# Altium project Project_1_27102024.PrjPcb
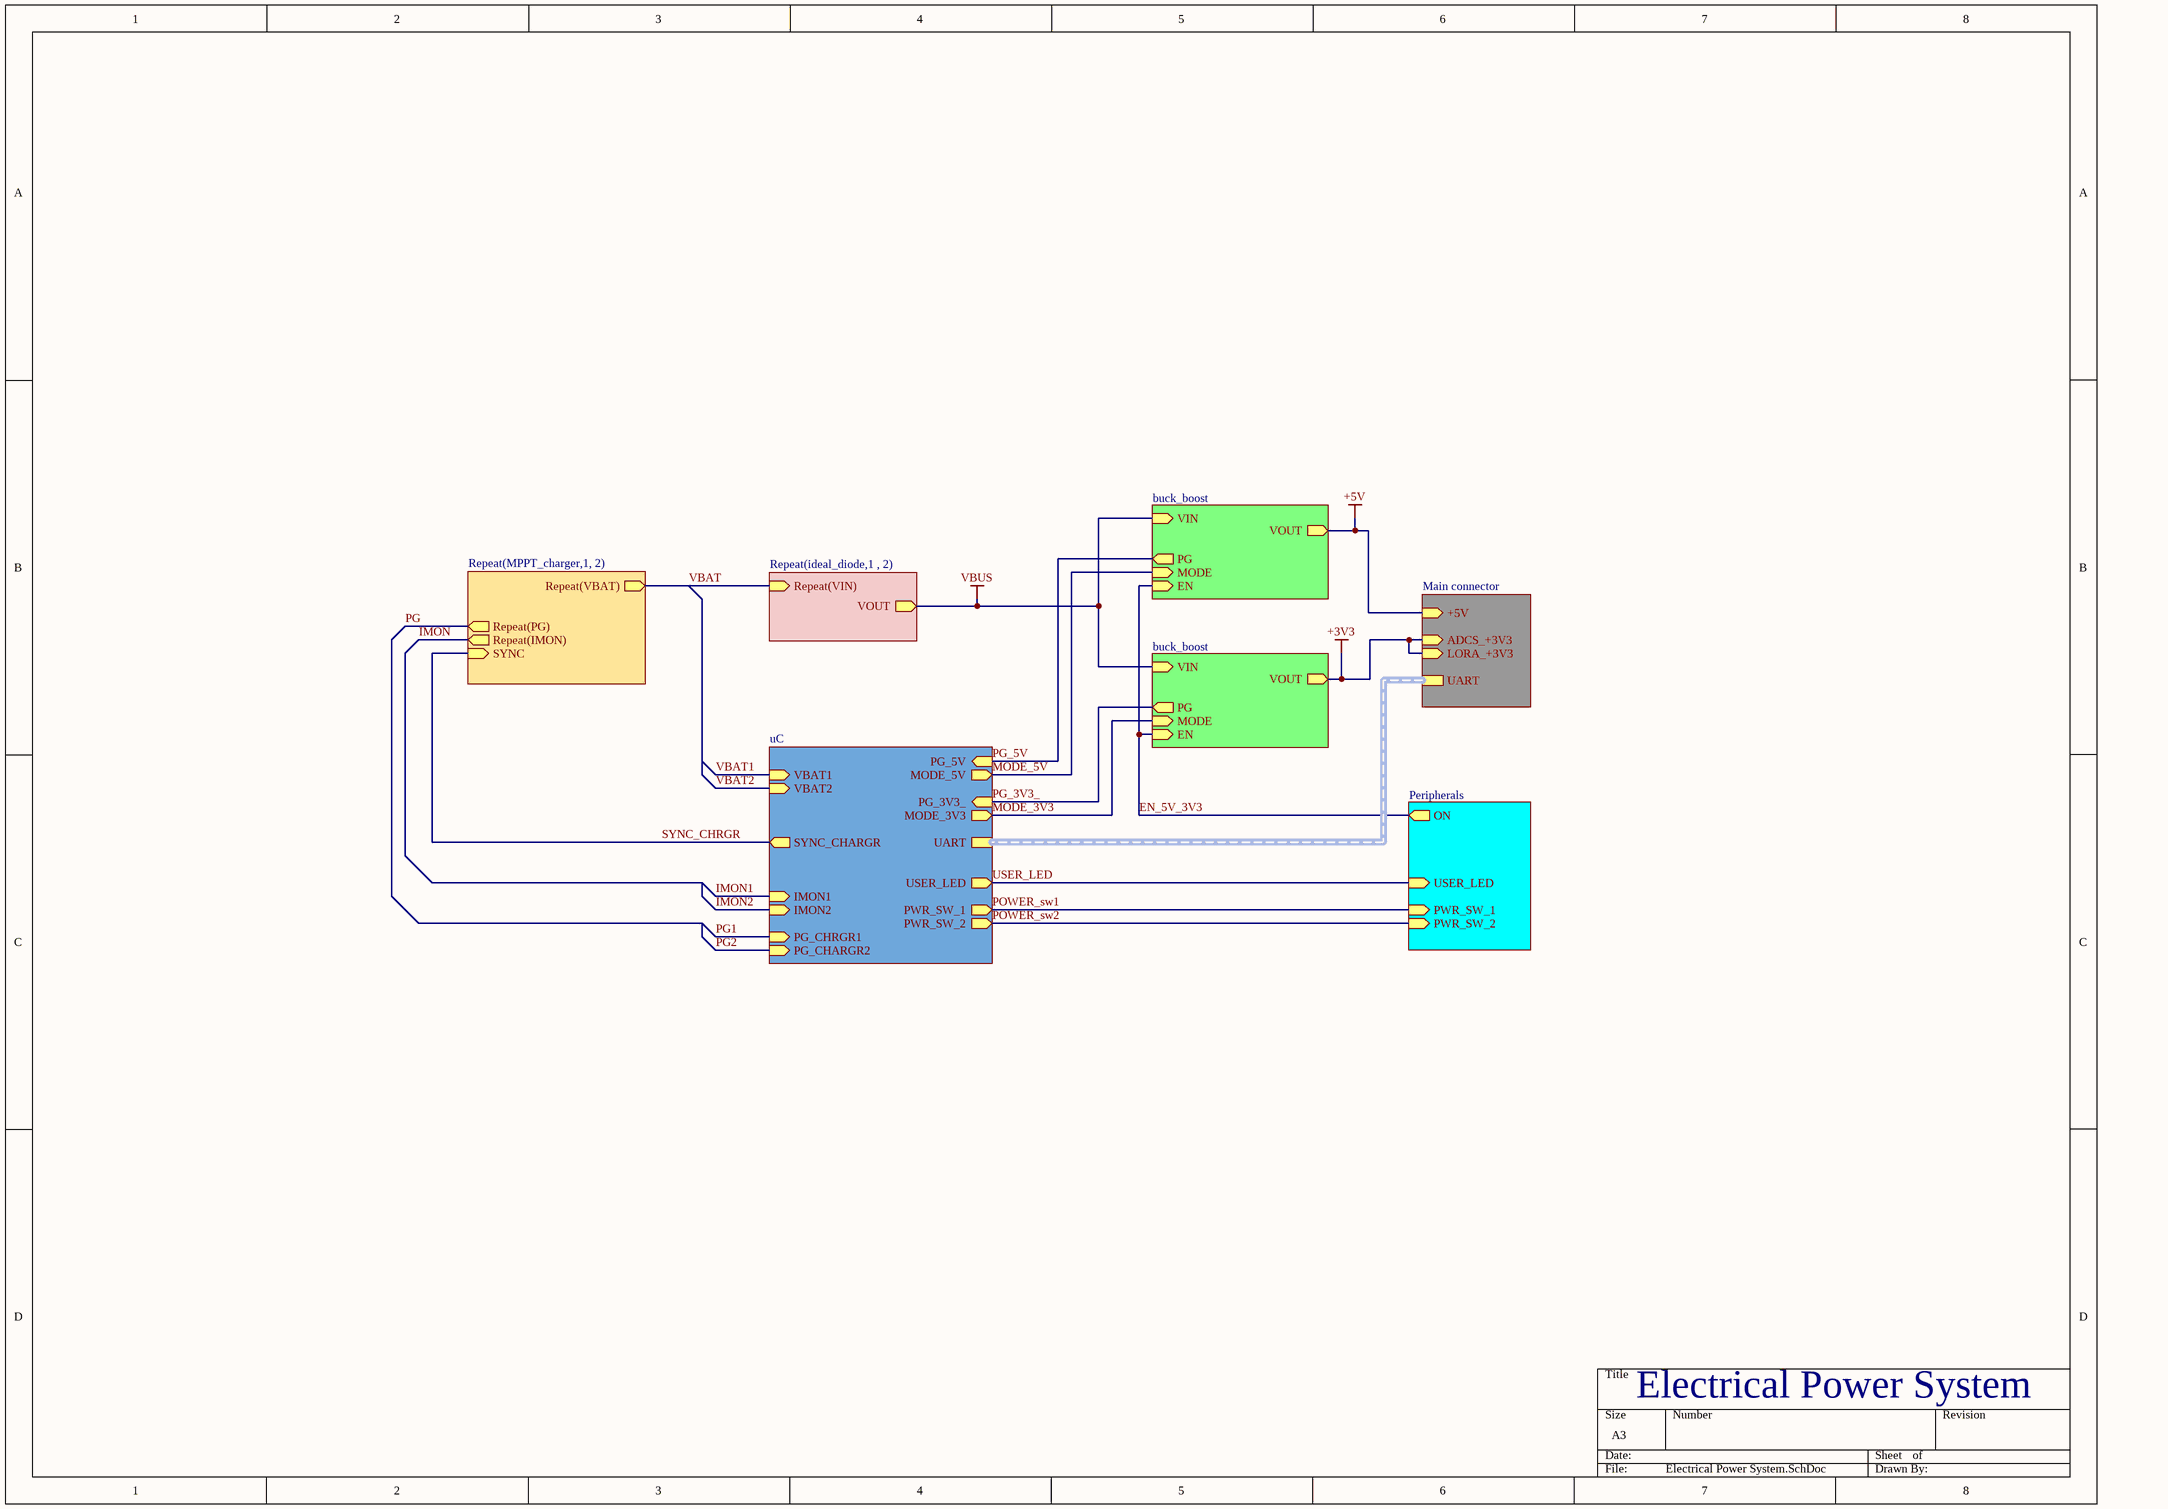
[diagram p0: Electrical Power System.SchDoc]
7 sheets, 124 parts. Net scope: hierarchical (ports join the sheet entries above them; power ports are global).
Board files: PCB-4-Layer.PcbDoc, PCB-2-Layer.PcbDoc, PCB-2-Layer_(1).PcbDoc
Sheets:
  Electrical Power System.SchDoc
    U_Microcontroller = uC.SchDoc
    MPPT_charger1 = Repeat(MPPT_charger,1, 2).SchDoc
    MPPT_charger2 = Repeat(MPPT_charger,1, 2).SchDoc
    ideal diode1 = Repeat(ideal_diode,1 , 2).SchDoc
    ideal diode2 = Repeat(ideal_diode,1 , 2).SchDoc
    U_Buck - Boost Converter = buck_boost.SchDoc
    U_LEDs Connector = Peripherals.SchDoc
    U_Board-to-board Connector = Main connector.SchDoc
    U_Buck - Boost Converter = buck_boost.SchDoc

## Sheet Electrical Power System.SchDoc
size A3; SheetNumber: 1; SheetTotal: 7

### Sub-sheets
Repeat(ideal diode, 1, 2) = Repeat(ideal_diode,1 , 2): VOUT (out), Repeat(VIN) (in)
Repeat(MPPT_charger, 1, 2) = Repeat(MPPT_charger,1, 2): SYNC (in), Repeat(IMON) (out), Repeat(PG) (out), Repeat(VBAT) (out)
U_Board-to-board Connector = Main connector: ADCS_+3V3 (in), LORA_+3V3 (in), +5V (in), UART (harness *)
U_Buck - Boost Converter = buck_boost: VIN (in), MODE (in), EN (in), PG (out), VOUT (out)
U_Buck - Boost Converter = buck_boost: VIN (in), MODE (in), EN (in), PG (out), VOUT (out)
U_LEDs Connector = Peripherals: USER_LED (in), PWR_SW_1 (in), PWR_SW_2 (in), ON (out)
U_Microcontroller = uC: IMON1 (in), IMON2 (in), SYNC_CHARGR (out), PG_3V3_ (in), MODE_3V3 (out), PG_5V (in), MODE_5V (out), PG_CHRGR1 (in), PG_CHARGR2 (in), USER_LED (out), PWR_SW_2 (out), PWR_SW_1 (out), UART (harness *), VBAT1 (in), VBAT2 (in)

### Nets
+3V3: sheet U_Board-to-board Connector/ADCS_+3V3, sheet U_Board-to-board Connector/LORA_+3V3, sheet U_Buck - Boost Converter/VOUT
+5V: sheet U_Buck - Boost Converter/VOUT, sheet U_Board-to-board Connector/+5V
VBUS: sheet Repeat(ideal diode, 1, 2)/VOUT, sheet U_Buck - Boost Converter/VIN, sheet U_Buck - Boost Converter/VIN  [project net SENSE]
EN_5V_3V3: sheet U_Buck - Boost Converter/EN, sheet U_LEDs Connector/ON, sheet U_Buck - Boost Converter/EN  [project net EN]
IMON: sheet Repeat(MPPT_charger, 1, 2)/Repeat(IMON)
MODE_3V3: sheet U_Microcontroller/MODE_3V3, sheet U_Buck - Boost Converter/MODE
MODE_5V: sheet U_Microcontroller/MODE_5V, sheet U_Buck - Boost Converter/MODE
PG: sheet Repeat(MPPT_charger, 1, 2)/Repeat(PG)
PG_3V3_: sheet U_Microcontroller/PG_3V3_, sheet U_Buck - Boost Converter/PG
PG_5V: sheet U_Microcontroller/PG_5V, sheet U_Buck - Boost Converter/PG
POWER_sw1: sheet U_Microcontroller/PWR_SW_1, sheet U_LEDs Connector/PWR_SW_1
POWER_sw2: sheet U_Microcontroller/PWR_SW_2, sheet U_LEDs Connector/PWR_SW_2
SYNC_CHRGR: sheet U_Microcontroller/SYNC_CHARGR, sheet Repeat(MPPT_charger, 1, 2)/SYNC
USER_LED: sheet U_Microcontroller/USER_LED, sheet U_LEDs Connector/USER_LED
VBAT: sheet Repeat(MPPT_charger, 1, 2)/Repeat(VBAT), sheet Repeat(ideal diode, 1, 2)/Repeat(VIN)

### Buses and harness runs
harness sheet U_Board-to-board Connector/UART = sheet U_Microcontroller/UART

### Notes on the sheet
- Electrical Power System

## Sheet uC.SchDoc
size A3; SheetNumber: 2; SheetTotal: 7
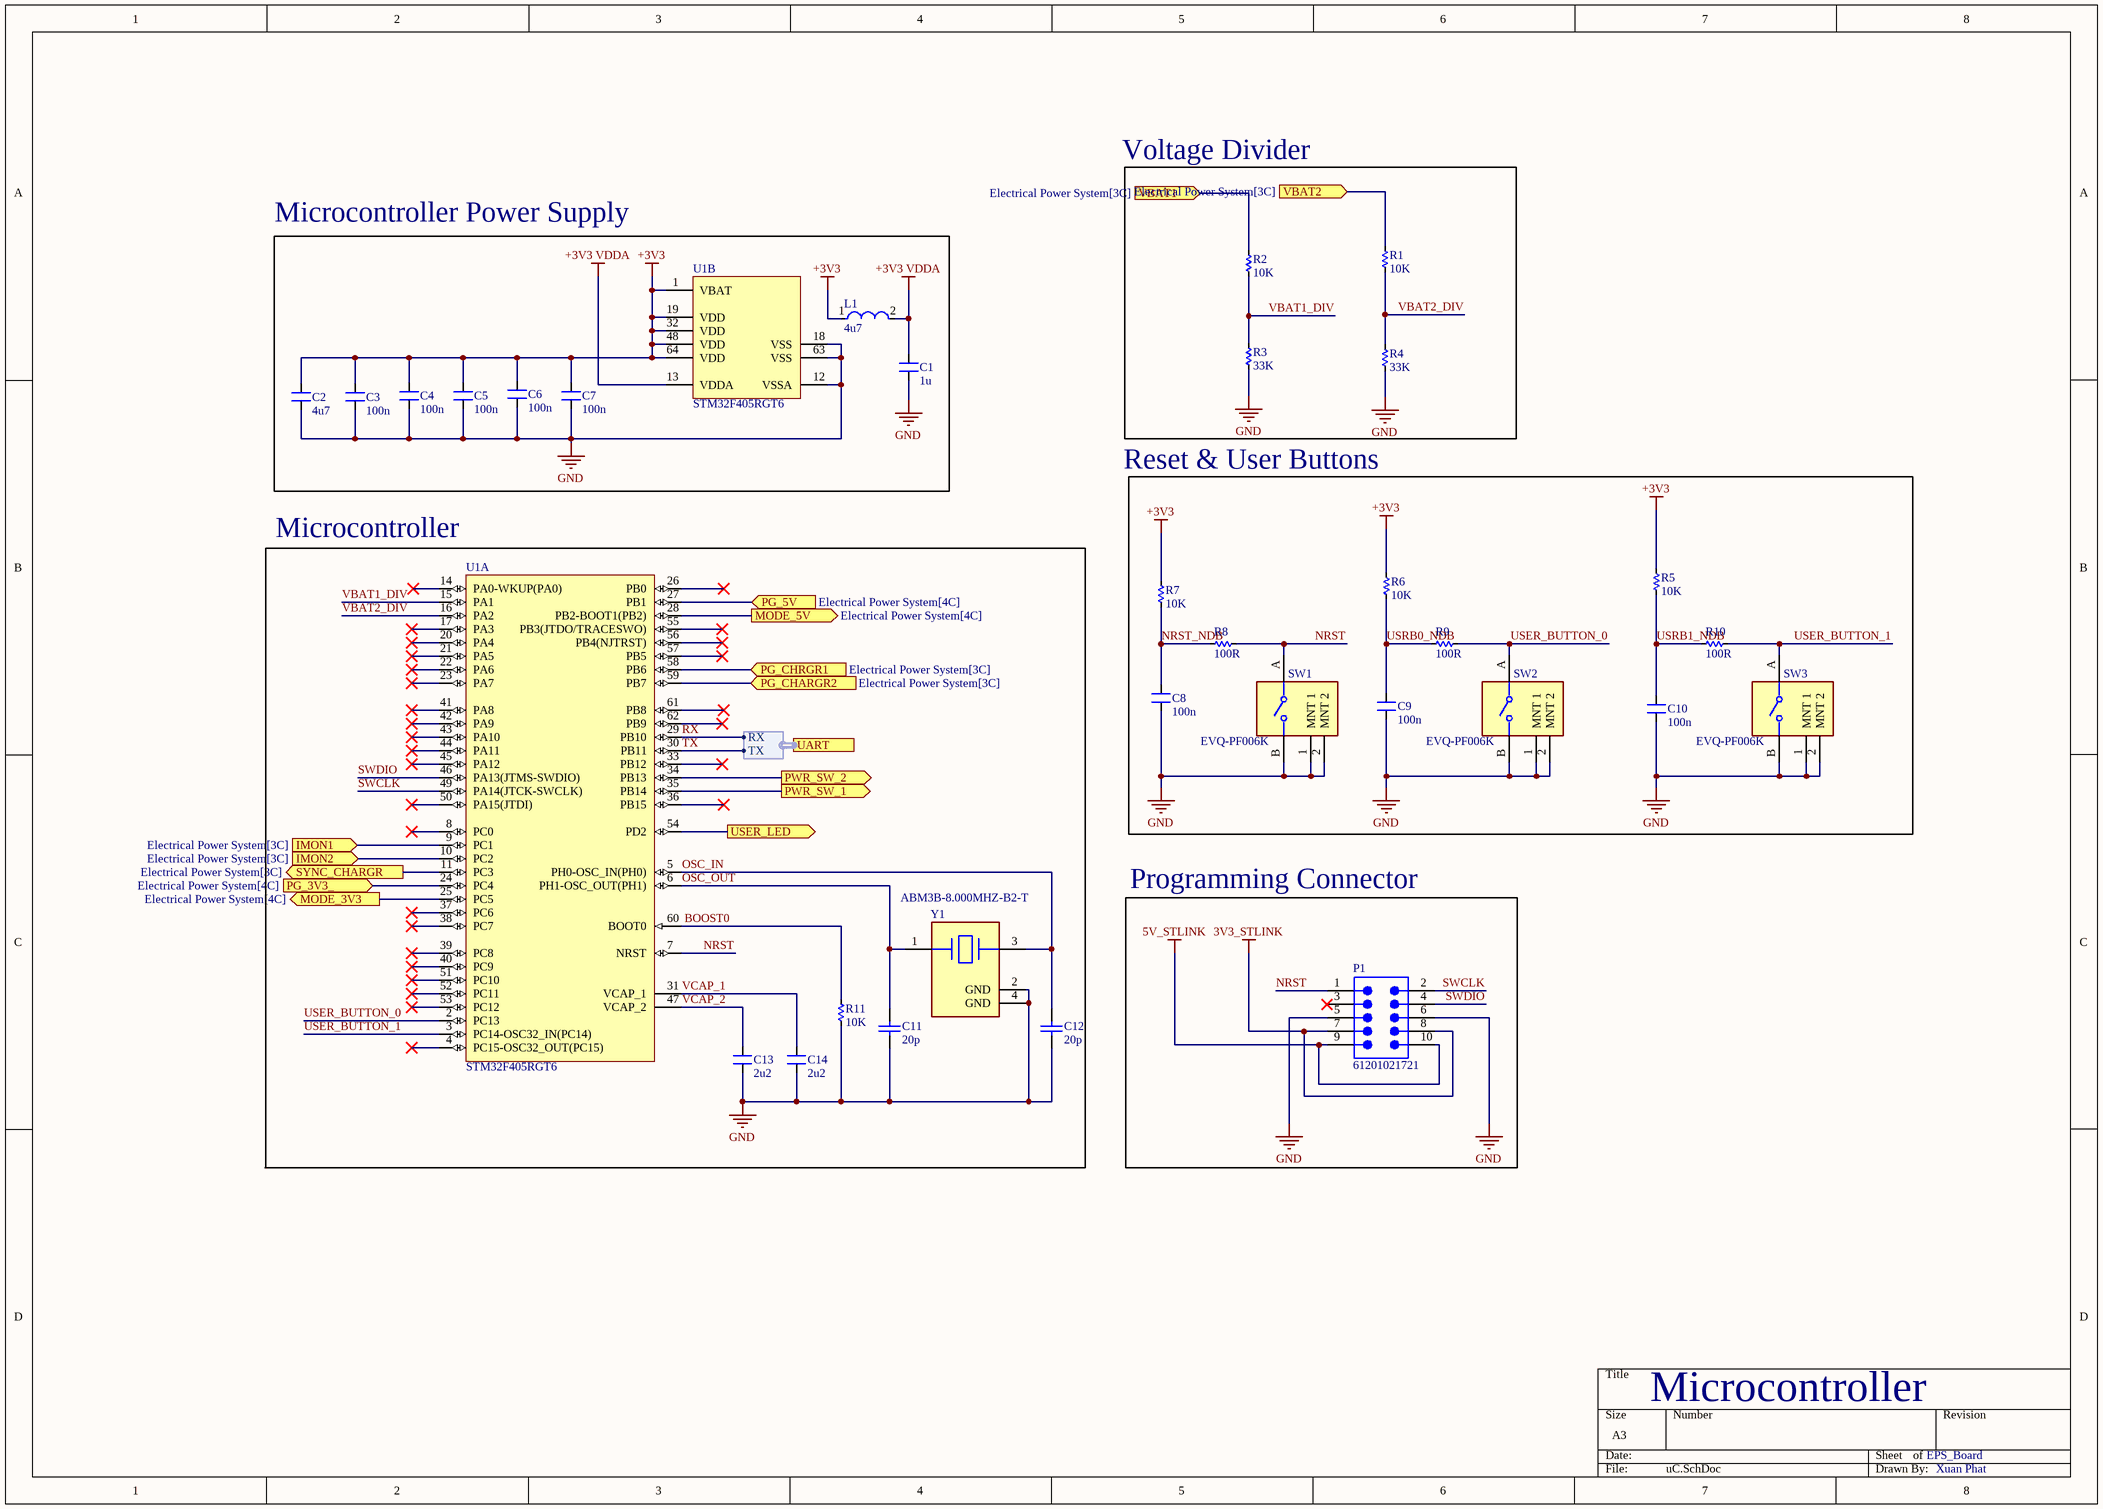
[diagram p1: uC.SchDoc]

### Parts
C1  1u  [CN-SMD-0603]
C2  4u7  [CN-SMD-0603]
C3  100n  [CN-SMD-0603]
C4  100n  [CN-SMD-0603]
C5  100n  [CN-SMD-0603]
C6  100n  [CN-SMD-0603]
C7  100n  [CN-SMD-0603]
C8  100n  [CN-SMD-0603]
C9  100n  [CN-SMD-0603]
C10  100n  [CN-SMD-0603]
C11  20p  [CAPC1608X90X30LL10T20]
C12  20p  [CAPC1608X90X30LL10T20]
C13  2u2  [CN-SMD-0603]
C14  2u2  [CN-SMD-0603]
L1  4u7  [FP-LQM2HPN_G0-IPC_A]
P1  61201021721  [61201021721]
R1  10K  [RES-SMD-0805]
R2  10K  [RES-SMD-0805]
R3  33K  [RES-SMD-0805]
R4  33K  [RES-SMD-0805]
R5  10K  [RES-SMD-0805]
R6  10K  [RES-SMD-0805]
R7  10K  [RES-SMD-0805]
R8  100R  [RES-SMD-0805]
R9  100R  [RES-SMD-0805]
R10  100R  [RES-SMD-0805]
R11  10K  [RES-SMD-0805]
SW1  EVQ-PF006K  [FP-EVQ-PF006K-MFG]
SW2  EVQ-PF006K  [FP-EVQ-PF006K-MFG]
SW3  EVQ-PF006K  [FP-EVQ-PF006K-MFG]
U1  STM32F405RGT6  [STM-LQFP64_M]  (parts A,B of 2)
Y1  ABM3B-8.000MHZ-B2-T  [FP-ABM3B-MFG]

### Blocks framed on the sheet
Voltage Divider: R1-R4
Microcontroller Power Supply: C1-C7 L1 U1
Microcontroller: C11-C14 R11 U1 Y1
Programming Connector: P1

### Ports
IMON1 (in, see Electrical Power System[3C]), IMON2 (in, see Electrical Power System[3C]), MODE_3V3 (out, see Electrical Power System[4C]), MODE_5V (out, see Electrical Power System[4C]), PG_3V3_ (in, see Electrical Power System[4C]), PG_5V (in, see Electrical Power System[4C]), PG_CHARGR2 (in, see Electrical Power System[3C]), PG_CHRGR1 (in, see Electrical Power System[3C]), PWR_SW_1 (out, see Electrical Power System[4C], Peripherals[2B]), PWR_SW_2 (out, see Electrical Power System[4C], Peripherals[2C]), SYNC_CHARGR (out, see Electrical Power System[3C]), UART (harness *, see Electrical Power System[4C], Main connector[3C]), USER_LED (out, see Electrical Power System[4C], Peripherals[1B]), VBAT1 (in, see Electrical Power System[3C]), VBAT2 (in, see Electrical Power System[3C])

### Harnesses
*: RX, TX

### Nets
3V3_STLINK: P1.7 P1.8
5V_STLINK: P1.9 P1.10
+3V3: C2.2 C3.2 C4.2 C5.2 C6.2 C7.2 L1.1 R5.1 R6.1 R7.1 U1.1(VBAT) U1.19(VDD) U1.32(VDD) U1.48(VDD) U1.64(VDD)
+3V3 VDDA: C1.2 L1.2 U1.13(VDDA)
GND: C1.1 C2.1 C3.1 C4.1 C5.1 C6.1 C7.1 C8.1 C9.1 C10.1 C11.1 C12.1 C13.1 C14.1 P1.5 P1.6 R3.2 R4.2 R11.2 SW1.1(MNT_1) SW1.2(MNT_2) SW1.B SW2.1(MNT_1) SW2.2(MNT_2) SW2.B SW3.1(MNT_1) SW3.2(MNT_2) SW3.B U1.12(VSSA) U1.18(VSS) U1.63(VSS) Y1.2(GND) Y1.4(GND)
BOOST0: R11.1 U1.60(BOOT0)
IMON1: U1.9(PC1) ; port IMON1
IMON2: U1.10(PC2) ; port IMON2
MODE_3V3: U1.25(PC5) ; port MODE_3V3
MODE_5V: U1.28(PB2-BOOT1(PB2)) ; port MODE_5V
NRST: P1.1 R8.2 SW1.A U1.7(NRST)
NRST_NDB: C8.2 R7.2 R8.1
OSC_IN: C12.2 U1.5(PH0-OSC_IN(PH0)) Y1.3
OSC_OUT: C11.2 U1.6(PH1-OSC_OUT(PH1)) Y1.1
PG: U1.58(PB6) ; port PG_CHRGR1
PG: U1.59(PB7) ; port PG_CHARGR2  [a separate net that carries the same name]
PG_3V3_: U1.24(PC4) ; port PG_3V3_
PG_5V: U1.27(PB1) ; port PG_5V
POWER_sw1: U1.35(PB14) ; port PWR_SW_1
POWER_sw2: U1.34(PB13) ; port PWR_SW_2
RX: U1.29(PB10) ; port UART.RX
SWCLK: P1.2 U1.49(PA14(JTCK-SWCLK))
SWDIO: P1.4 U1.46(PA13(JTMS-SWDIO))
SYNC_CHRGR: U1.11(PC3) ; port SYNC_CHARGR
TX: U1.30(PB11) ; port UART.TX
USER_BUTTON_0: R9.2 SW2.A U1.2(PC13)
USER_BUTTON_1: R10.2 SW3.A U1.3(PC14-OSC32_IN(PC14))
USER_LED: U1.54(PD2) ; port USER_LED
USRB0_NDB: C9.2 R6.2 R9.1
USRB1_NDB: C10.2 R5.2 R10.1
VBAT1: R2.1 ; port VBAT1
VBAT1_DIV: R2.2 R3.1 U1.15(PA1)
VBAT2: R1.1 ; port VBAT2
VBAT2_DIV: R1.2 R4.1 U1.16(PA2)
VCAP_1: C14.2 U1.31(VCAP_1)
VCAP_2: C13.2 U1.47(VCAP_2)

Not connected (* = marked no-connect by the designer): P1 3*; U1 4(PC15-OSC32_OUT(PC15))* 8(PC0)* 14(PA0-WKUP(PA0))* 17(PA3)* 20(PA4)* 21(PA5)* 22(PA6)* 23(PA7)* 26(PB0)* 33(PB12)* 36(PB15)* 37(PC6)* 38(PC7)* 39(PC8)* 40(PC9)* 41(PA8)* 42(PA9)* 43(PA10)* 44(PA11)* 45(PA12)* 50(PA15(JTDI))* 51(PC10)* 52(PC11)* 53(PC12)* 55(PB3(JTDO/TRACESWO))* 56(PB4(NJTRST))* 57(PB5)* 61(PB8)* 62(PB9)*

### Notes on the sheet
- Reset & User Buttons
- Microcontroller
- EPS_Board
- Xuan Phat

### Library data of the parts
C1-C10 C13 C14 = Capacitors: Value: 33pF
C11 C12 = CMP-2000-06100-1: Chip Capacitor, 20 pF, +/- 5%, 50 V, -55 to 85 degC, 0603 (1608 Metric), RoHS, Tape and Reel; Manufacturer: Samsung Electro-Mechanics; Dielectric: C0G; Rated Voltage: 50V; Capacitance: 20pF; Tolerance (%): ±5%; Case Size/Dimension: 0603; Datasheet Version: 06/2016; Manufacturer URL: http://www.samsungsem.com/global/index.jsp; Datasheet URL: http://www.samsungsem.com/kr/support/product-search/mlcc/__icsFiles/afieldfile/2016/08/18/S_CL10C200JB8NNNC.pdf; Mounting Technology: SurfaceMount; Package Description: 2-Pin Surface Mount Device, Body 1.60 x 0.80 mm; Package Reference: 0603
L1 = CMP-06042-016771-1: Multilayer Type Inductor for Power Lines, 1008 (2520), 4.7μH, 20%, 0.138Ω, 1.1A; Shielding: Shielded; DC Resistance (DCR): 110mR; Core Material: Ferrite; Test Frequency: 1MHz; Inductance: 4.7uH; Self Resonant Frequency: 25MHz; Max DC Current: 1.1A; REACH SVHC: No SVHC; Series: LQM2HP_G0; Case Code (Metric): 2520; Current Rating: 1.1A; Packaging: Tape and Reel; Tolerance: 20%; Military Standard: Not; Min Operating Temperature: -55°C; RoHS Compliant: Yes; Width: 0.079inch; Depth: 2.2mm; Max Operating Temperature: 125°C; Package Quantity: 3000; Mount: Surface Mount; Termination: SMD/SMT; Height: 1.2mm; Case/Package: 1008; Rated Current-Max: 1.1A; Height - Seated (Max): 0.039inch; Case Code (Imperial): 1008; Radiation Hardening: No; Lead Free: Lead Free; DC Current: 1.1A; Length: 2.5mm; Inductance Tolerance: 20%
P1 = CMP-1502-00021-2: NexarPartId: 8917787; Operating Supply Voltage: 250V; Number of Positions: 10; Contact Resistance: 20mΩ; Connector Type: Male Pin; Current Rating: 3A; Pitch: 2.54mm; Gender: Male; Insulation Resistance: 1GΩ; Insulation: Insulated; Max Operating Temperature: 105°C; Flammability Rating: UL94 V-0; Mount: Through Hole; Contact Material: Copper; Min Operating Temperature: -40°C; Length: 20.36mm; Number of Contacts: 10; Height: 8.85mm; Number of Rows: 2; Housing Material: PBT; Color: Black; Contact Gender: Male; Orientation: Right Angle; Contact Plating: Gold; Number of Pins: 10; Voltage Rating (DC): 250V; RoHS: Compliant; Insulation Material: PBT; REACH SVHC: Unknown; Row Spacing: 2.54mm; Voltage Rating: 250V; Width: 20.36mm; Lead Pitch: 2.54mm; Termination: Through Hole
R1-R11 = Res SMD: SMD; Manufacturer: Generic Components; Class: Passive; Published: 08/06/2000; Publisher: Altium Hobart Technology Centre
SW1-SW3 = CMP-00287-39802768-1: EVQ-PF006K Switch Tactile N.O. SPST Round Button PC Pins 0.02A 15VDC 1N Thru-Hole Bulk; Voltage Rating (DC): 15V; Current Rating: 20mA; Actuator Length: 5.85mm; Life (Cycles): 100kcycles; Number of Positions: 2; Switch Function: Off-Mom; Switch Travel: 250µm; Contact Resistance: 50mΩ; Illumination Type: Illuminated, Non-Illuminated; NexarPartId: 39802768; Max Current Rating: 20mA; Color: Black; Height: 7.1mm; Throw Configuration: SPST; Width: 4mm; Packaging: Bulk; Mount: Through Hole; Operating Force: 1N; Lead Free: Lead Free; Contact Current Rating: 20mA; Length: 6.2mm; Max Operating Temperature: 70°C; Min Operating Temperature: -20°C; Contact Plating: Gold, Silver; Orientation: Right Angle; REACH SVHC: No SVHC; Termination: PC Pins; Mechanical Life: 100kcycles; Radiation Hardening: No; Electrical Life: 100kcycles; RoHS: Compliant; Max Voltage Rating (DC): 15V; Depth: 9.85mm
U1 = CMP-0243-00019-3: ARM Cortex-M4 32-bit MCU+FPU, 210 DMIPS, 1024 kB Flash, 192 kB Internal RAM, 51 I/Os, 64-pin LQFP, -40 to 85 degC, Tray; Manufacturer: STMicroelectronics; Supply Voltage(Vcc) min (V): 1.8; Supply Voltage(Vcc) max (V): 3.6; Internal RAM Size (kB): 192; I/Os (High Current): 51; D/A Converter: 2x12-bit; FLASH Size (Prog) (kB): 1024; Operating Frequency(F) (Processor speed) (MHz): 168; ComponentLink2Description: Datasheet; PackageVersion: Rev. 4, 06/2013; DatasheetVersion: Rev. 4; Core: ARM Cortex-M4; ComponentLink2URL: http://www.st.com/st-web-ui/static/active/en/resource/technical/document/datasheet/DM00037051.pdf; PackageReference: LQFP64; Packing: Tray; ComponentLink1Description: Manufacturer URL; ComponentLink3URL: http://www.st.com/st-web-ui/static/active/en/resource/technical/document/datasheet/DM00037051.pdf; ComponentLink3Description: Package Specification; Mounting Technology: Surface Mount; ComponentLink1URL: http://www.st.com/web/en/home.html; PackageDescription: 64-Pin Low Profile Quad Flat Package, 10 x 10 mm Body, 0.5 mm Pitch; PartNumber: STM32F405RGT6
Y1 = CMP-1688-00002-2: Crystal 8MHz ±20ppm 18pF SMD-4 5mm x 3.2mm; ESR (Equivalent Series Resistance): 200R; Frequency Stability: 50ppm; Operating Frequency: 8 MHz; Mount: Surface Mount; Number of Pins: 4; Packaging: Tape and Reel; Width: 0.126inch; Case/Package: CSMD; Lead Free: Lead Free; Depth: 3.2mm; Load Capacitance: 18pF; Min Operating Temperature: -20°C; Series: ABM3B; Package Quantity: 1000; Resistor Type: Ceramic; Height: 0.043inch; Max Operating Temperature: 70°C; Frequency Tolerance: 20ppm; Series Resistance: 200R; Tolerance: 20ppm; Termination: SMD/SMT; Length: 5mm; Frequency: 8MHz

## Sheet Repeat(MPPT_charger,1, 2).SchDoc
size A3; SheetNumber: 3; SheetTotal: 7
Used 2 times, as channels MPPT_charger1, MPPT_charger2. Parts and nets are listed once, with the designators drawn on the sheet.
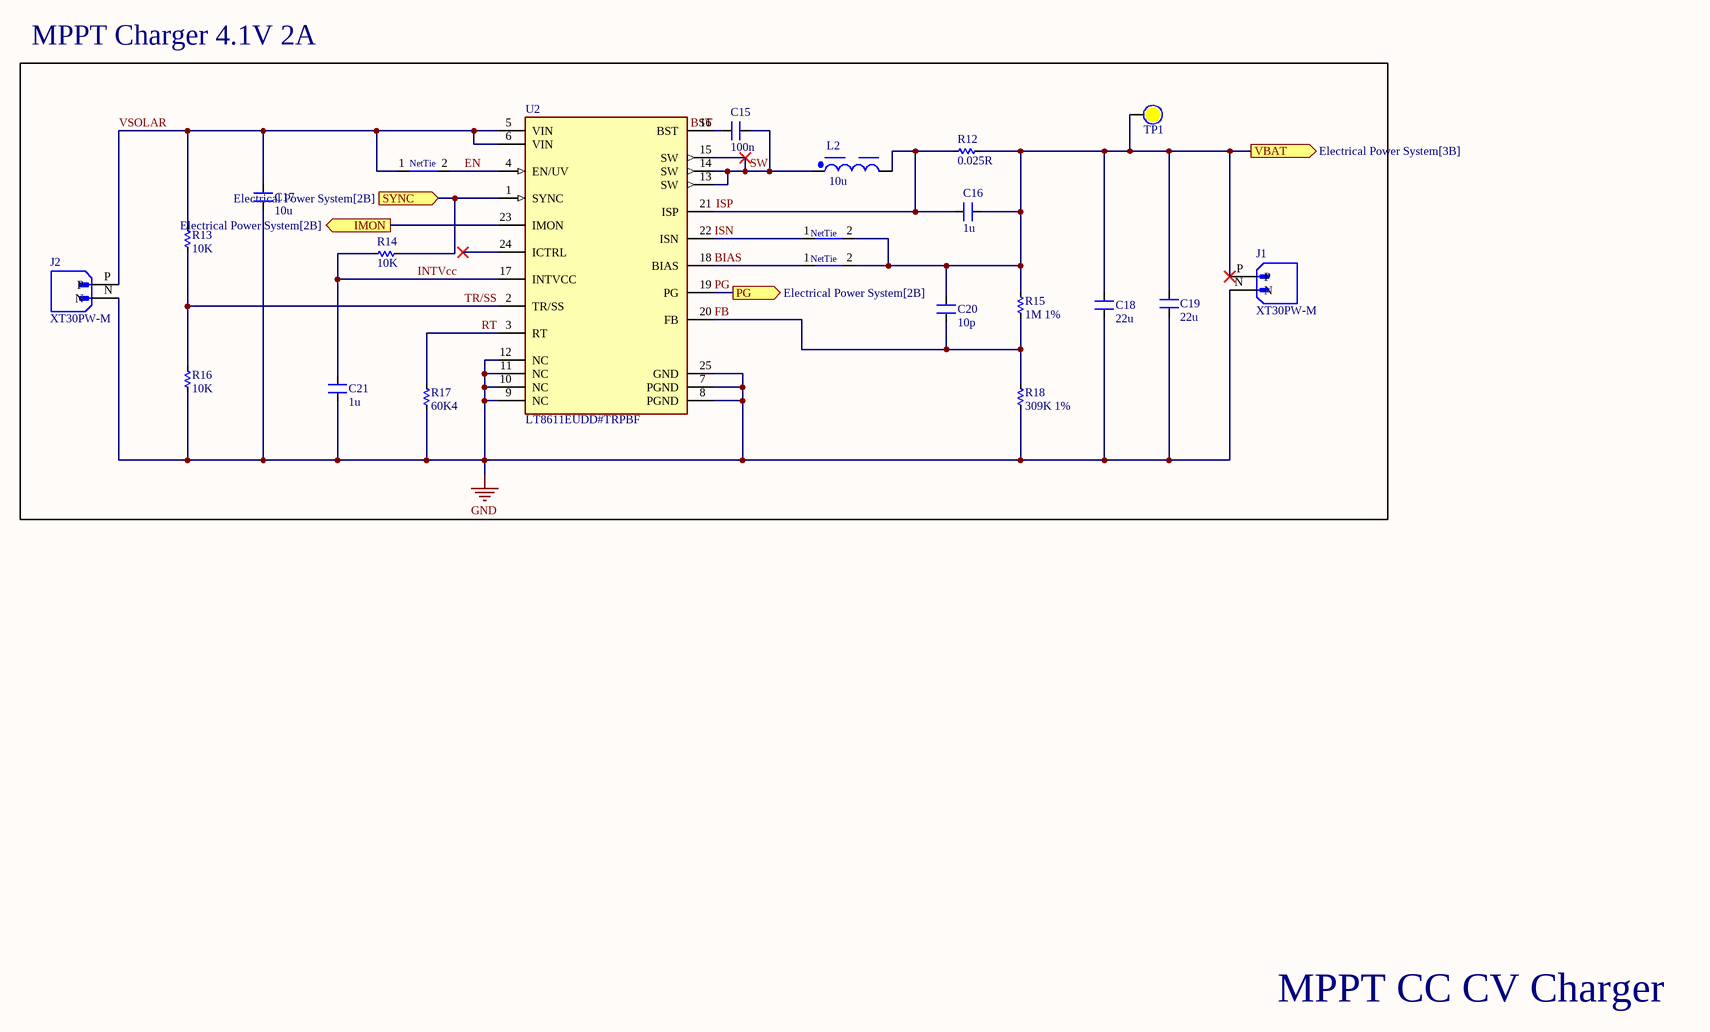
[diagram p2: Repeat(MPPT_charger,1, 2).SchDoc]

### Parts
C15  100n  [CN-SMD-0603]
C16  1u  [CN-SMD-0603]
C17  10u  [CN-SMD-1206]
C18  22u  [CN-SMD-1206]
C19  22u  [CN-SMD-1206]
C20  10p  [CN-SMD-0603]
C21  1u  [CN-SMD-0603]
J1  XT30PW-M  [AMASS_XT30PW-M]
J2  XT30PW-M  [AMASS_XT30PW-M]
L2  10u  [WE-PD_7345]
NT1  NetTie  [NETTIE_SMD]  (net tie, no BOM)
NT2  NetTie  [NETTIE_SMD]  (net tie, no BOM)
NT3  NetTie  [NETTIE_SMD]  (net tie, no BOM)
R12  0.025R  [RES-SMD-0805]
R13  10K  [RES-SMD-0805]
R14  10K  [RES-SMD-0805]
R15  1M 1%  [RES-SMD-0805]
R16  10K  [RES-SMD-0805]
R17  60K4  [RES-SMD-0805]
R18  309K 1%  [RES-SMD-0805]
TP1  TestPoint  [Test Point 1 MM]  (value not drawn)  (no BOM)
U2  LT8611EUDD#TRPBF  [FP-UDD-24-05-08-1833-IPC_B]

### Blocks framed on the sheet
MPPT Charger 4.1V 2A: C15-C21 J1 J2 L2 NT1-NT3 R12-R18 TP1 U2

### Ports
IMON (out, see Electrical Power System[2B]), PG (out, see Electrical Power System[2B]), SYNC (in, see Electrical Power System[2B]), VBAT (out, see Electrical Power System[3B])

### Nets
GND: C17.1 C18.1 C19.1 C21.1 J1.N J2.N R16.1 R17.1 R18.2 U2.7(PGND) U2.8(PGND) U2.9(NC) U2.10(NC) U2.11(NC) U2.12(NC) U2.25(GND)
BIAS: NT3.1 U2.18(BIAS)
BST: C15.2 U2.16(BST)
EN: NT1.2 U2.4(EN/UV)
FB: C20.1 R15.2 R18.1 U2.20(FB)
IMON: U2.23(IMON) ; port IMON
INTVcc: C21.2 R14.2 U2.17(INTVCC)
ISN: NT2.1 U2.22(ISN)
ISP: C16.2 L2.2 R12.2 U2.21(ISP)
PG: U2.19(PG) ; port PG
RT: R17.2 U2.3(RT)
SW: C15.1 L2.1 U2.13(SW) U2.14(SW) U2.15(SW)
SYNC: R14.1 U2.1(SYNC) ; port SYNC
TR/SS: R13.1 R16.2 U2.2(TR/SS)
VBAT: C16.1 C18.2 C19.2 C20.2 J1.P NT2.2 NT3.2 R12.1 R15.1 TP1.0 ; port VBAT
VSOLAR: C17.2 J2.P NT1.1 R13.2 U2.5(VIN) U2.6(VIN)

Not connected (* = marked no-connect by the designer): U2 24(ICTRL)*

### Channels
MPPT_charger1: designators end in _MPPT_charger1; ports IMON=IMON1 PG=PG SYNC=SYNC_CHRGR VBAT=VBAT1
MPPT_charger2: designators end in _MPPT_charger2; ports IMON=IMON2 PG=PG SYNC=SYNC_CHRGR VBAT=VBAT2

### Notes on the sheet
- MPPT CC CV Charger

### Library data of the parts
C15-C21 = Capacitors: Value: 33pF
J1 J2 = XT30PW-M: Socket; DC supply; XT30; male; PIN: 2; on PCBs; THT; Colour: yellow; MF: AMASS; SnapEDA_Link: https://www.snapeda.com/parts/XT30PW-M/AMASS/view-part/?ref=snap; Package: None; Value: *; MP: XT30PW-M; Check_prices: https://www.snapeda.com/parts/XT30PW-M/AMASS/view-part/?ref=eda
L2 = CMP-0227-00113-2: NexarPartId: 11853718; Saturation Current: 2.6A; Current Rating: 2A; DC Resistance (DCR): 45mΩ; Inductance Tolerance: 20%; Core Material: Ferrite; Shielding: Shielded; Test Frequency: 1kHz; Inductance: 10µH; Self Resonant Frequency: 23MHz; RoHS: Compliant; Ambient Temperature Range Low: -40°C; Case/Package: Nonstandard; Composition: Wirewound; Height - Seated (Max): 4.4958mm; Mount: Surface Mount; Max DC Current: 2A; Length: 7.3mm; Termination: SMD/SMT; Depth: 7.3mm; Lead Pitch: 4mm; Ambient Temperature Range High: 85°C; Max Operating Temperature: 125°C; Width: 7.3mm; Lead Free: Lead Free; Min Operating Temperature: -40°C; Tolerance: 20%; Packaging: Cut Tape (CT); Number of Pins: 2; Height: 4.5mm
NT1-NT3 = NetTie_SMD: Net Tie SMD
R12-R18 = Res SMD: as R1 on sheet uC; Published: 08/06/2000; Publisher: Altium Hobart Technology Centre
TP1 = Test Point: Solder: NF
U2 = CMP-0491-02169-2: IC REG BUCK ADJ 2.5A 24QFN; Synchronous Rectifier: Yes; Number of Outputs: 1; Output Type: Adjustable; Switching Frequency: 2MHz; Efficiency: 96%; Output Voltage: 40V; Max Operating Temperature: 125°C; Output Current: 2.5A; RoHS Compliant: Yes; Case/Package: QFN; Package Quantity: 2500; Lead Free: Lead Free; Series: -; Number of Pins: 24; Min Operating Temperature: -40°C; Packaging: Tape and Reel

## Sheet Repeat(ideal_diode,1 , 2).SchDoc
size A4; SheetNumber: 4; SheetTotal: 7
Used 2 times, as channels ideal diode1, ideal diode2. Parts and nets are listed once, with the designators drawn on the sheet.
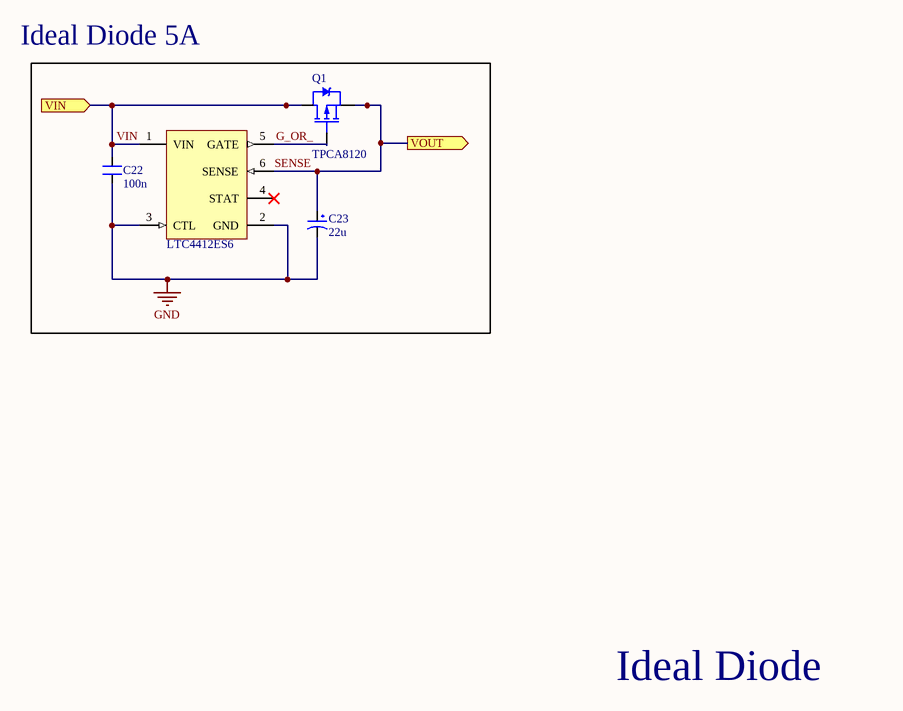
[diagram p3: Repeat(ideal_diode,1 , 2).SchDoc]

### Parts
C22  100n  [CN-SMD-0603]
C23  22u  [TANTALUM_SMD_1206]
Q1  TPCA8120  [TPCA8120]
U3  LTC4412ES6  [LT-S6-6-TSOT-23_L]

### Ports
VIN (in, see Electrical Power System[3B]), VOUT (out, see Electrical Power System[4B])

### Nets
GND: C22.1 C23.2 U3.2(GND) U3.3(CTL)
G_OR_: Q1.4(G) U3.5(GATE)
SENSE: C23.1 Q1.1,2,3(S) U3.6(SENSE) ; port VOUT
VIN: C22.2 Q1.5,6,7,8(D) U3.1(VIN) ; port VIN

Not connected (* = marked no-connect by the designer): U3 4(STAT)*

### Channels
ideal diode1: designators end in _ideal_diode1; ports VIN=VBAT1 VOUT=SENSE
ideal diode2: designators end in _ideal_diode2; ports VIN=VBAT2 VOUT=SENSE

### Notes on the sheet
- Ideal Diode 5A
- Ideal Diode

### Library data of the parts
C22 = Capacitors: Value: 33pF
C23 = Cap_Tantalum SMD: SMD; Chung_Loai: Dán; Don_Vi: Con; So_Chan: 2; Ten_Linh_Kien: Tụ tantalum 477A-470uF 10V SMD7343; Ma_Hang: MH001956; Kieu_Chan: *
U3 = CMP-0479-00433-1: Low Loss PowerPath(TM) Controller, 2.5 to 28 V Vin, 6-pin SOT23 (S6-6), -40 to 85 degC; Manufacturer: Linear Technology; Ideal Diode: Single, External, P-Channel; PackageVersion: Jun-10; Code_JEDEC: MO-193; PackageReference: S6-6; ComponentLink2Description: Datasheet; Mounting Technology: Surface Mount; PackageDescription: 6-Pin Plastic TSOT-23, Body 2.9 x 1.63 mm, Pitch 0.95 mm; ComponentLink1URL: http://www.linear.com/; RoHS: FALSE; ComponentLink3Description: Package Specification; ComponentLink2URL: http://cds.linear.com/docs/en/datasheet/4412fa.pdf; ComponentLink1Description: Manufacturer URL; ComponentLink3URL: http://cds.linear.com/docs/en/packaging/SOT_6_05-08-1636.pdf; PartNumber: LTC4412ES6

## Sheet buck_boost.SchDoc
size A3; SheetNumber: 5; SheetTotal: 7
Used 2 times, as channels U_Buck - Boost Converter, U_Buck - Boost Converter. Parts and nets are listed once, with the designators drawn on the sheet.
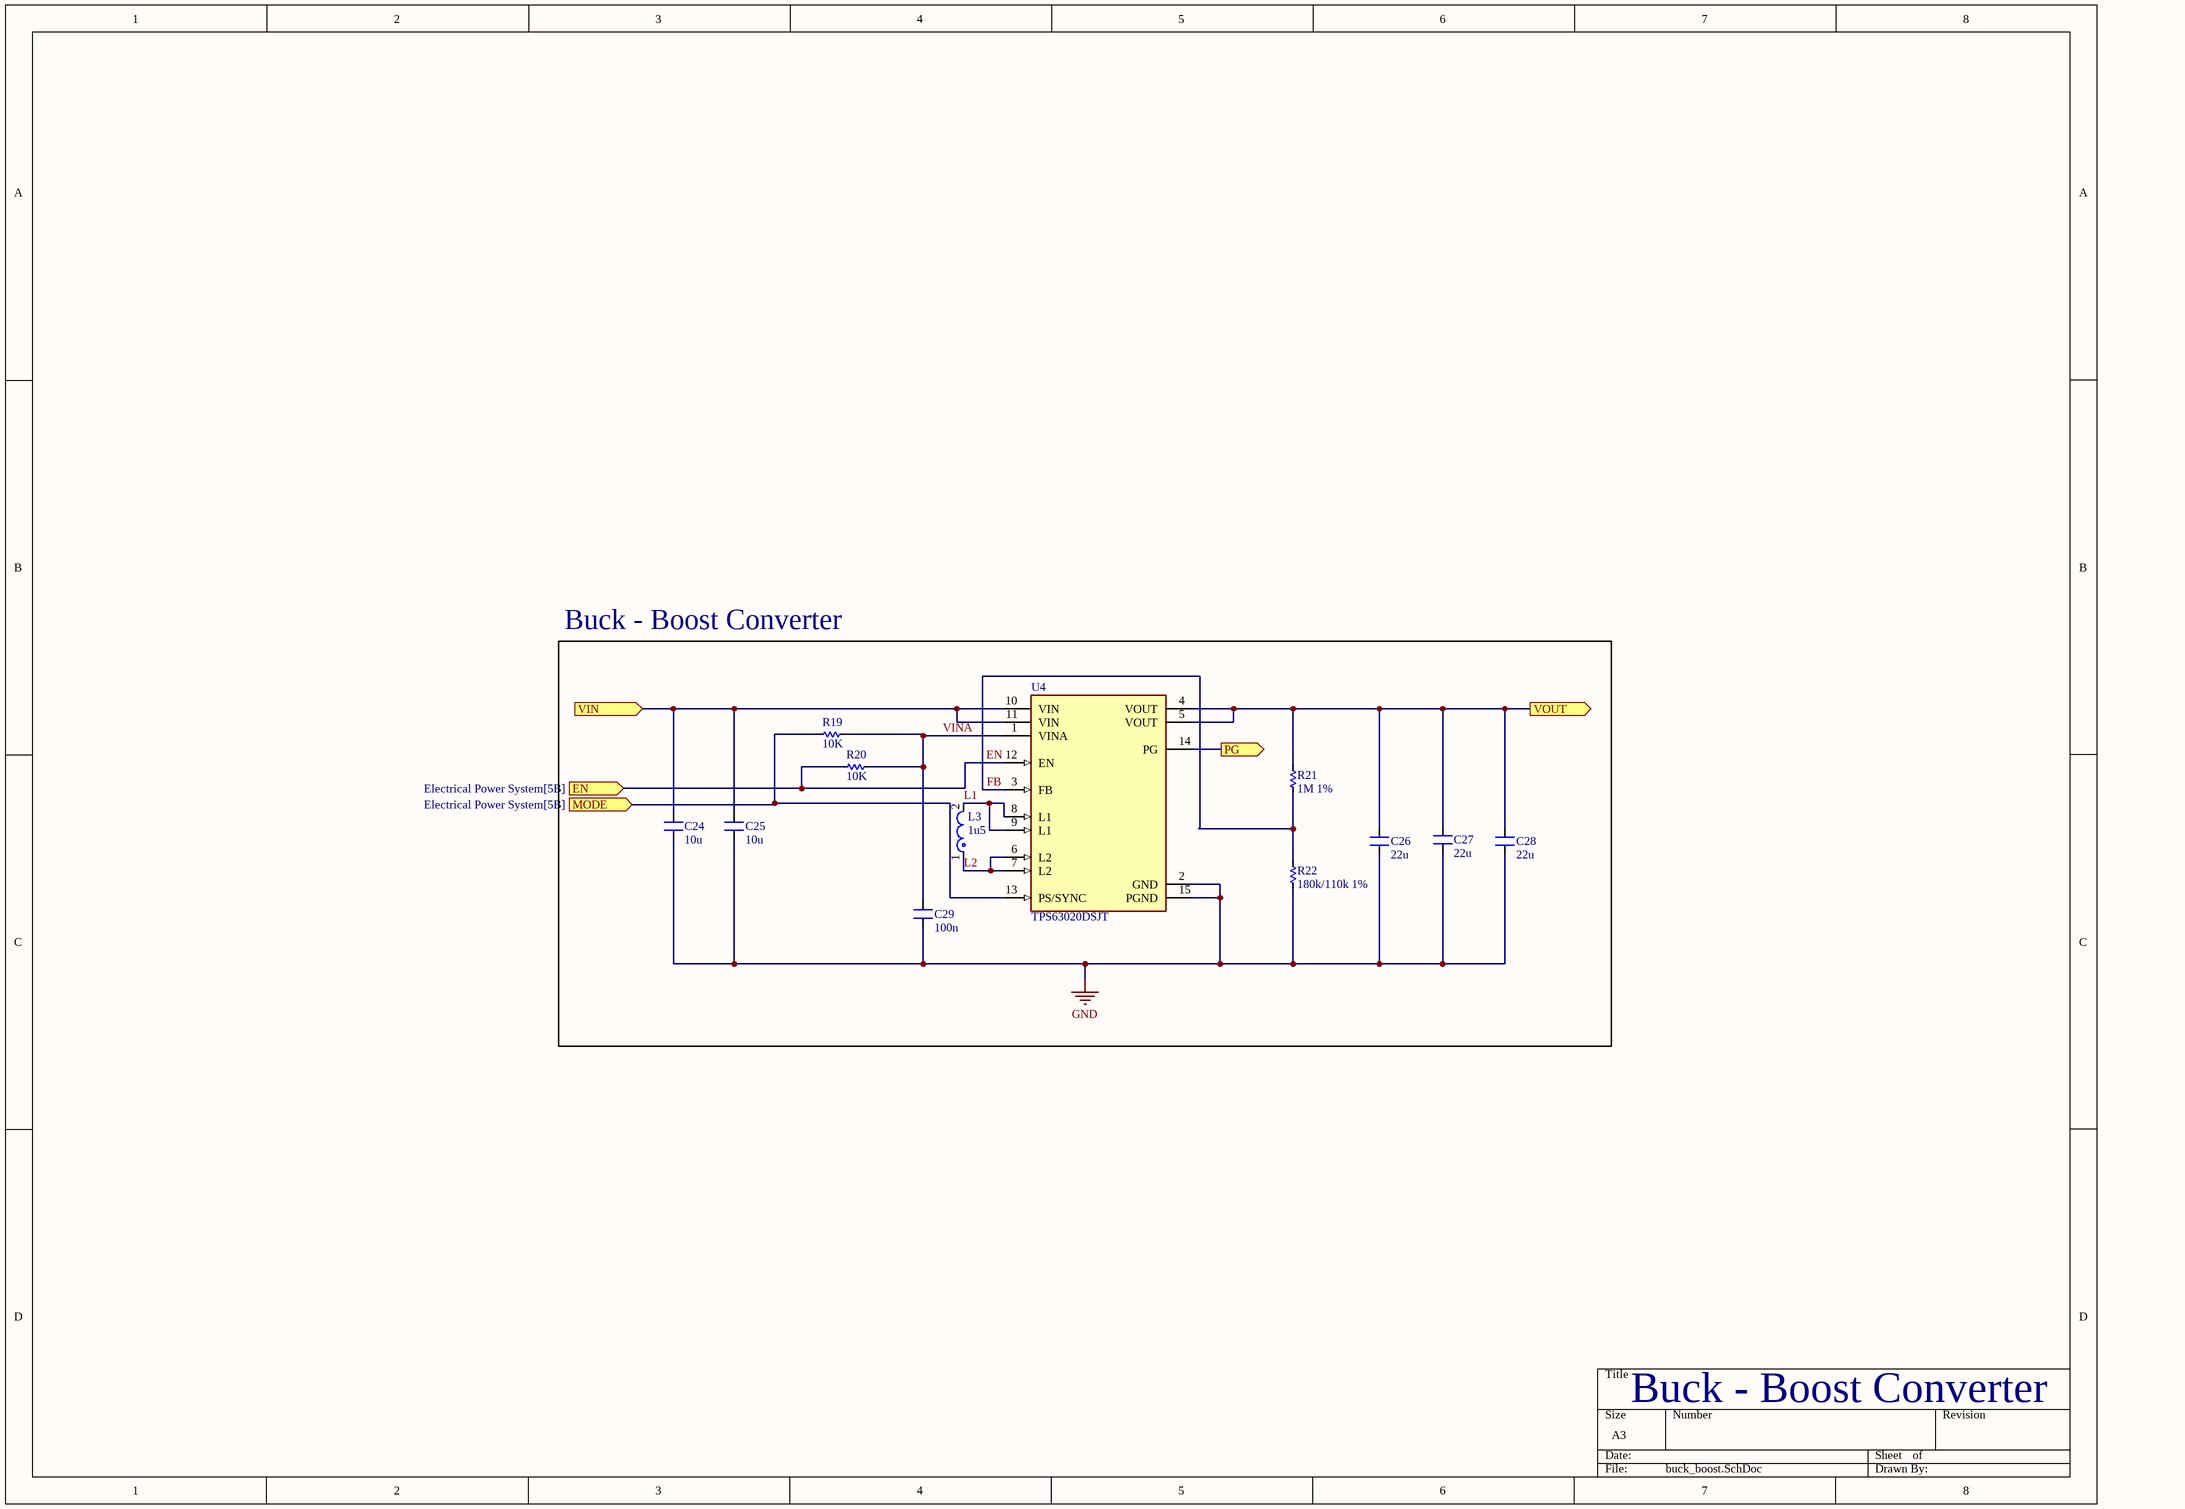
[diagram p4: buck_boost.SchDoc]

### Parts
C24  10u  [CN-SMD-0603]
C25  10u  [CN-SMD-0603]
C26  22u  [CN-SMD-0603]
C27  22u  [CN-SMD-0603]
C28  22u  [CN-SMD-0603]
C29  100n  [CN-SMD-0603]
L3  1u5  [FP-XFL4020-MFG]
R19  10K  [RES-SMD-0805]
R20  10K  [RES-SMD-0805]
R21  1M 1%  [RES-SMD-0805]
R22  180k/110k 1%  [RES-SMD-0805]
U4  TPS63020DSJT  [FP-DSJ0014A-MFG]

### Blocks framed on the sheet
Buck - Boost Converter: C24-C29 L3 R19-R22 U4

### Ports
EN (in, see Electrical Power System[5B]), MODE (in, see Electrical Power System[5B]), PG (out, see Electrical Power System[5B]), VIN (in, see Electrical Power System[5B]), VOUT (out, see Electrical Power System[6B])

### Nets
GND: C24.1 C25.1 C26.1 C27.1 C28.1 C29.1 R22.2 U4.2(GND) U4.15(PGND)
EN: R20.2 U4.12(EN) ; port EN
FB: R21.2 R22.1 U4.3(FB)
L1: L3.2 U4.8(L1) U4.9(L1)
L2: L3.1 U4.6(L2) U4.7(L2)
MODE: R19.2 U4.13(PS/SYNC) ; port MODE
PG: U4.14(PG) ; port PG
VIN: C24.2 C25.2 U4.10(VIN) U4.11(VIN) ; port VIN
VINA: C29.2 R19.1 R20.1 U4.1(VINA)
VOUT: C26.2 C27.2 C28.2 R21.1 U4.4(VOUT) U4.5(VOUT) ; port VOUT

### Channels
U_Buck - Boost Converter: designators end in _U_Buck_-_Boost_Converter#1; ports EN=EN MODE=MODE_5V PG=PG_5V VIN=SENSE VOUT=+5V
U_Buck - Boost Converter: designators end in _U_Buck_-_Boost_Converter#2; ports EN=EN MODE=MODE_3V3 PG=PG_3V3_ VIN=SENSE VOUT=+3V3

### Notes on the sheet
- Buck - Boost Converter

### Library data of the parts
C24-C29 = Capacitors: Value: 33pF
L3 = CMP-11268-000104-1: Inductor Power Shielded Wirewound 1.5uH 20% 100KHz 9.1A 15.8mOhm DCR 1515 Automotive Embossed Plastic T/R; Core Material: Composite; DC Resistance (DCR): 15.8mR; Saturation Current: 4.1A; Self Resonant Frequency: 59MHz; Tolerance: 20%; Inductance: 1.5uH; Max DC Current: 9.1A; RoHS Compliant: Yes; Max Operating Temperature: 125°C; Length: 4.3mm; Case/Package: SMD/SMT; Mount: Surface Mount; Shielding: Shielded; Min Operating Temperature: -40°C; RMS Current (Irms): 9.1A; Test Frequency: 100kHz; Inductance Tolerance: 20%; REACH SVHC: No SVHC; Packaging: Tape and Reel; Termination: SMD/SMT; Lead Free: Contains Lead; Width: 4.3mm; Series: XFL4020; Height: 2.1mm
R19-R22 = Res SMD: as R1 on sheet uC; Published: 08/06/2000; Publisher: Altium Hobart Technology Centre
U4 = CMP-2000-07282-2: IC REG BCK BST ADJ 3.5A 14VSON; Manufacturer: Texas Instruments; Switching Frequency: 2400kHz; Output Voltage: 1.2-5.5V; Nominal Supply Current: 25uA; Standoff Height: 0mm; Switching Topology: Buck-Boost; Min Supply Voltage: 1.8V; Output Type: AdjustableProgrammable; Max Junction Temp: +125°C; Number Of Outputs: 1; Output Current: 3A; Max Supply Voltage: 5.5V; ComponentLink2URL: https://www.ti.com/lit/ds/symlink/tps63020.pdf; Ambient Temperature Range High: +85°C; Digikey Description: IC REG BCK BST ADJ 3.5A 14VSON; Ambient Temperature Range Low: -40°C; Manufacturer Part Number: TPS63020DSJT; Automotive: No; Package: DSJ0014A; Category: IC; Temperature Range High: +85°C; Temperature: -40°C to +85°C; Octopart: https://octopart.com/tps63020dsjt-texas+instruments-12976119; Temperature Range Low: -40°C; Device Class L3: Voltage Regulators - Switching; Device Class L2: Power Management ICs; RoHS: TRUE; Lead Free: Yes; Height: 1mm; Device Class L1: Integrated Circuits (ICs); Mouser Description: Voltage Regulators - Switching Regulators 93% Eff Buck-Boost Converter; ComponentLink2Description: Datasheet

## Sheet Peripherals.SchDoc
size A4; SheetNumber: 7; SheetTotal: 7
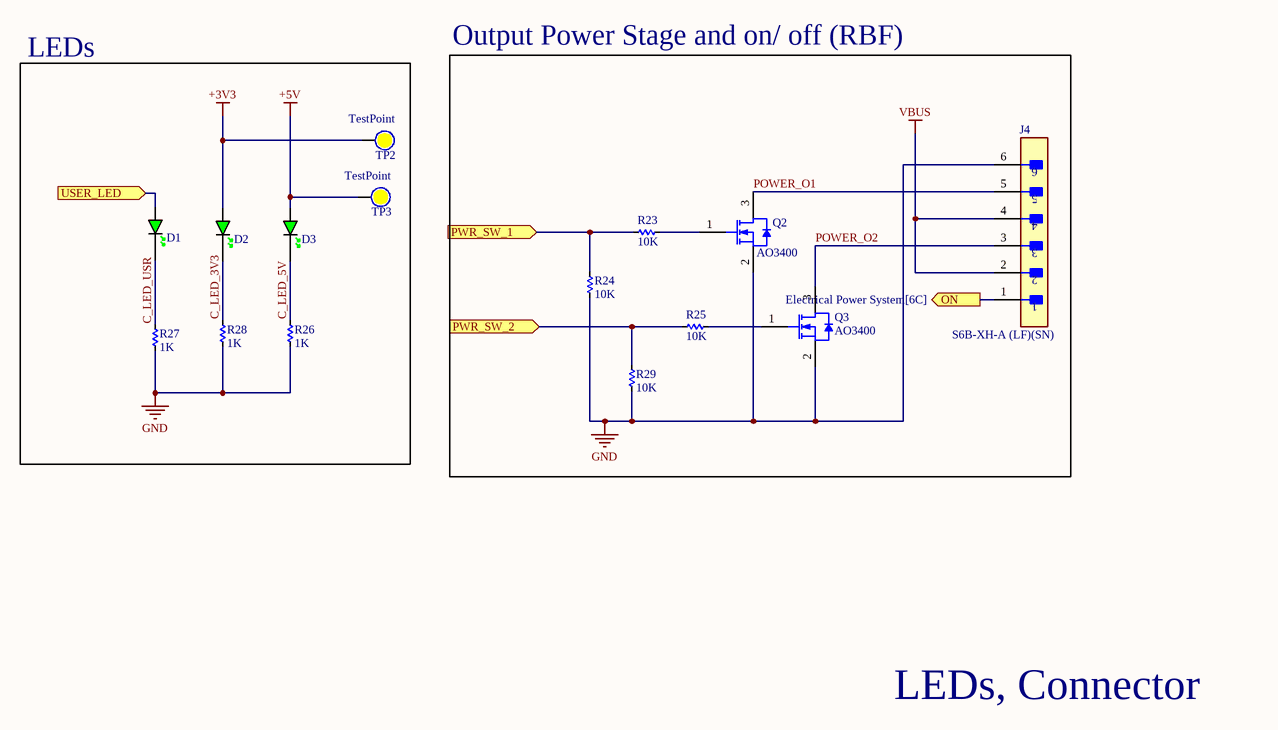
[diagram p5: Peripherals.SchDoc]

### Parts
D1  GREEN  [LED_0603_GREEN]  (value not drawn)
D2  GREEN  [LED_0603_GREEN]  (value not drawn)
D3  GREEN  [LED_0603_GREEN]  (value not drawn)
J4  S6B-XH-A (LF)(SN)  [FP-S6B-XH-A_LF_SN-MFG]
Q2  AO3400  [AO-SOT23-3_V]
Q3  AO3400  [AO-SOT23-3_V]
R23  10K  [RES-SMD-0805]
R24  10K  [RES-SMD-0805]
R25  10K  [RES-SMD-0805]
R26  1K  [RES-SMD-0805]
R27  1K  [RES-SMD-0805]
R28  1K  [RES-SMD-0805]
R29  10K  [RES-SMD-0805]
TP2  TestPoint  [Test Point 1 MM]  (no BOM)
TP3  TestPoint  [Test Point 1 MM]  (no BOM)

### Blocks framed on the sheet
LEDs: D1-D3 R26-R28 TP2 TP3
Output Power Stage and on/ off (RBF): J4 Q2 Q3 R23-R25 R29

### Ports
ON (out, see Electrical Power System[6C]), PWR_SW_1 (in, see Electrical Power System[6C], uC[3C]), PWR_SW_2 (in, see Electrical Power System[6C], uC[3C]), USER_LED (in, see Electrical Power System[6C], uC[3C])

### Nets
+3V3: D2.A TP2.0
+5V: D3.A TP3.0
GND: J4.6 Q2.2(S) Q3.2(S) R24.2 R26.2 R27.2 R28.2 R29.2
VBUS: J4.2 J4.4  [project net SENSE]
C_LED_3V3: D2.K R28.2
C_LED_5V: D3.K R26.2
C_LED_USR: D1.K R27.2
EN: J4.1 ; port ON
POWER_O1: J4.5 Q2.3(D)
POWER_O2: J4.3 Q3.3(D)
POWER_sw1: R23.1 R24.1 ; port PWR_SW_1
POWER_sw2: R25.1 R29.1 ; port PWR_SW_2
USER_LED: D1.A ; port USER_LED
NetQ2_1: Q2.1(G) R23.2
NetQ3_1: Q3.1(G) R25.2

### Notes on the sheet
- LEDs, Connector

### Library data of the parts
D1-D3 = LED_0603_GREEN: LED 0603 GREEN SMD
J4 = CMP-17439-000165-2: CONN HEADER R/A 6POS 2.5MM; Number of Contacts: 6; Contact Resistance: 20mR; Max Current Rating: 3A; Max Voltage Rating (AC): 250V; Gender: Male; Insulation Resistance: 1GR; Wire/Cable Gauge: 22AWG; Fastening Type: Detent; Lead Pitch: 2.5mm; Flammability Rating: UL94 V-0; Contact Finish - Mating: TIN; Housing Material: Polyamide; Length: 17.4mm; Termination: Solder; Contact Type: Male Pin; Number of Positions: 6; Mount: Through Hole; Orientation: Right Angle; Voltage Rating (AC): 250V; Contact Shape: Square; Lead Free: Lead Free; Insulation Material: Nylon; Insulation Color: Natural; Contact Plating: Tin; Connector Type: Header; Housing Color: White; Color: Natural; Package Quantity: 500; Contact Material: Brass; Packaging: Bulk; Pitch: 2.5mm; Series: XH; Number of Rows: 1; Min Operating Temperature: -25°C; Voltage Rating: 250V; REACH SVHC: No SVHC; Current Rating: 3A; Depth: 11.5mm; Max Operating Temperature: 85°C
Q2 Q3 = CMP-0278-00001-1: N-channel Enhancement Mode Field-Effect Transistor; 5.8A/30V; Manufacturer: Alpha and Omega; Channel Type: N; Drain-Source Voltage Limit: 30 V; Junction Temperature: -55 to 150 degC; Gate-Source Voltage Limit: +/-12 V; PackageDescription: 3-Pin SOT23, 3.016 x 2.8 mm Body, 0.95 mm Pitch; ComponentLink2Description: Datasheet; DatasheetVersion: Rev.8, 12/2011; ComponentLink3URL: http://www.aosmd.com/res/packaging_information/SOT-23.pdf; Storage Temperature: -55 to 150 degC; ComponentLink3Description: Package Specification; PackageReference: SOT23; ComponentLink1Description: Manufacturer URL; Mounting Technology: Surface Mount; ComponentLink1URL: http://www.aosmd.com/; PartNumber: AO3400; ComponentLink2URL: http://www.aosmd.com/res/data_sheets/AO3400.pdf
R23-R29 = Res SMD: as R1 on sheet uC; Published: 08/06/2000; Publisher: Altium Hobart Technology Centre
TP2 TP3 = Test Point: Solder: NF

## Sheet Main connector.SchDoc
size A3; SheetNumber: 6; SheetTotal: 7
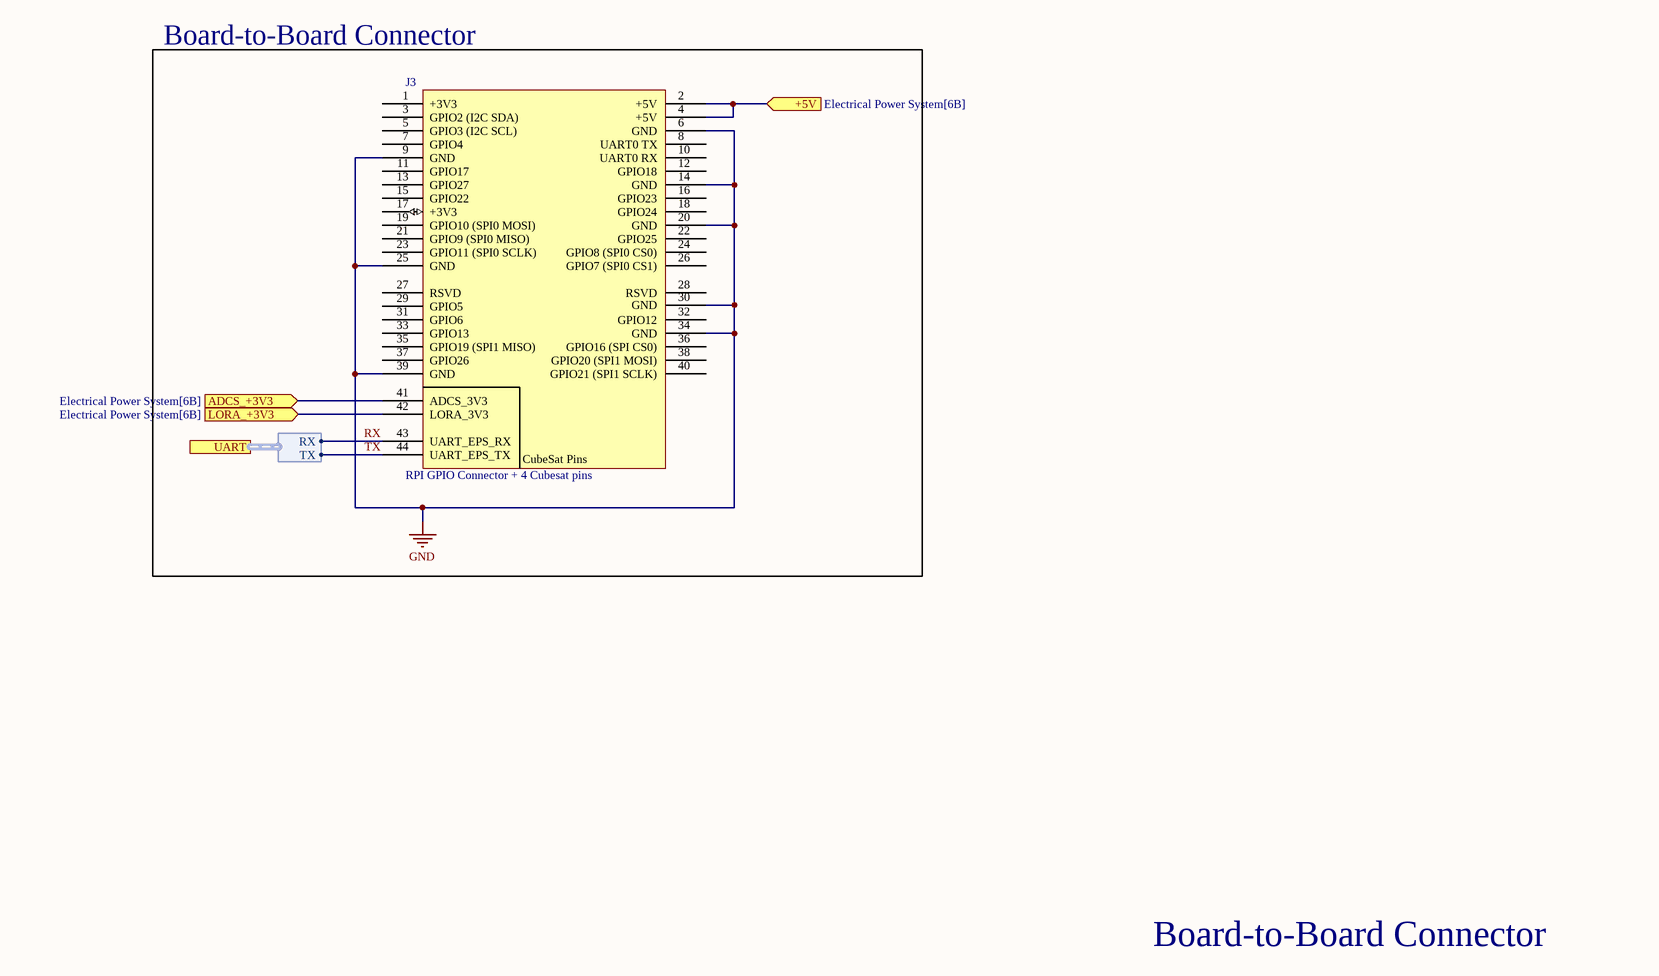
[diagram p6: Main connector.SchDoc]

### Parts
J3  RPI GPIO Connector + 4 Cubesat pins  [header 44 pin]

### Blocks framed on the sheet
Board-to-Board Connector: J3

### Ports
+5V (in, see Electrical Power System[6B]), ADCS_+3V3 (in, see Electrical Power System[6B]), LORA_+3V3 (in, see Electrical Power System[6B]), UART (harness *, see Electrical Power System[6B], uC[4B])

### Harnesses
*: RX, TX

### Nets
+3V3: J3.41(ADCS_3V3) J3.42(LORA_3V3) ; port ADCS_+3V3, port LORA_+3V3
+5V: J3.2(+5V) J3.4(+5V) ; port +5V
GND: J3.6(GND) J3.9(GND) J3.14(GND) J3.20(GND) J3.25(GND) J3.30(GND) J3.34(GND) J3.39(GND)
RX: J3.43(UART_EPS_RX) ; port UART.RX
TX: J3.44(UART_EPS_TX) ; port UART.TX

Not connected (* = marked no-connect by the designer): J3 1(+3V3) 3(GPIO2_(I2C_SDA)) 5(GPIO3_(I2C_SCL)) 7(GPIO4) 8(UART0_TX) 10(UART0_RX) 11(GPIO17) 12(GPIO18) 13(GPIO27) 15(GPIO22) 16(GPIO23) 17(+3V3) 18(GPIO24) 19(GPIO10_(SPI0_MOSI)) 21(GPIO9_(SPI0_MISO)) 22(GPIO25) 23(GPIO11_(SPI0_SCLK)) 24(GPIO8_(SPI0_CS0)) 26(GPIO7_(SPI0_CS1)) 27(RSVD) 28(RSVD) 29(GPIO5) 31(GPIO6) 32(GPIO12) 33(GPIO13) 35(GPIO19_(SPI1_MISO)) 36(GPIO16_(SPI_CS0)) 37(GPIO26) 38(GPIO20_(SPI1_MOSI)) 40(GPIO21_(SPI1_SCLK))

### Notes on the sheet
- Board-to-Board Connector
- (in symbol header 44 pin) CubeSat Pins

### Library data of the parts
J3 = header 44 pin

## Nets that join several sheets
+3V3: uC (15 pins), Peripherals (D2.A TP2.0), Main connector (J3.41 J3.42), U_Buck - Boost Converter (6 pins)
+5V: U_Buck - Boost Converter (6 pins), Peripherals (D3.A TP3.0), Main connector (J3.2 J3.4)
GND: uC (33 pins), MPPT_charger1 (16 pins), MPPT_charger2 (16 pins), ideal diode1 (C22_ideal_diode1.1 C23_ideal_diode1.2 U3_ideal_diode1.2 U3_ideal_diode1.3), ideal diode2 (C22_ideal_diode2.1 C23_ideal_diode2.2 U3_ideal_diode2.2 U3_ideal_diode2.3), U_Buck - Boost Converter (9 pins), Peripherals (8 pins), Main connector (8 pins), U_Buck - Boost Converter (9 pins)
SENSE: ideal diode1 (C23_ideal_diode1.1 Q1_ideal_diode1.1,2,3 U3_ideal_diode1.6), ideal diode2 (C23_ideal_diode2.1 Q1_ideal_diode2.1,2,3 U3_ideal_diode2.6), U_Buck - Boost Converter (C24_U_Buck_-_Boost_Converter#1.2 C25_U_Buck_-_Boost_Converter#1.2 U4_U_Buck_-_Boost_Converter#1.10 U4_U_Buck_-_Boost_Converter#1.11), Peripherals (J4.2 J4.4), U_Buck - Boost Converter (C24_U_Buck_-_Boost_Converter#2.2 C25_U_Buck_-_Boost_Converter#2.2 U4_U_Buck_-_Boost_Converter#2.10 U4_U_Buck_-_Boost_Converter#2.11)
EN: U_Buck - Boost Converter (R20_U_Buck_-_Boost_Converter#1.2 U4_U_Buck_-_Boost_Converter#1.12), Peripherals (J4.1), U_Buck - Boost Converter (R20_U_Buck_-_Boost_Converter#2.2 U4_U_Buck_-_Boost_Converter#2.12)
IMON1: uC (U1.9), MPPT_charger1 (U2_MPPT_charger1.23)
IMON2: uC (U1.10), MPPT_charger2 (U2_MPPT_charger2.23)
MODE_3V3: uC (U1.25), U_Buck - Boost Converter (R19_U_Buck_-_Boost_Converter#2.2 U4_U_Buck_-_Boost_Converter#2.13)
MODE_5V: uC (U1.28), U_Buck - Boost Converter (R19_U_Buck_-_Boost_Converter#1.2 U4_U_Buck_-_Boost_Converter#1.13)
PG: uC (U1.58), MPPT_charger1 (U2_MPPT_charger1.19)
PG: uC (U1.59), MPPT_charger2 (U2_MPPT_charger2.19)
PG_3V3_: uC (U1.24), U_Buck - Boost Converter (U4_U_Buck_-_Boost_Converter#2.14)
PG_5V: uC (U1.27), U_Buck - Boost Converter (U4_U_Buck_-_Boost_Converter#1.14)
POWER_sw1: uC (U1.35), Peripherals (R23.1 R24.1)
POWER_sw2: uC (U1.34), Peripherals (R25.1 R29.1)
RX: uC (U1.29), Main connector (J3.43)
SYNC_CHRGR: uC (U1.11), MPPT_charger1 (R14_MPPT_charger1.1 U2_MPPT_charger1.1), MPPT_charger2 (R14_MPPT_charger2.1 U2_MPPT_charger2.1)
TX: uC (U1.30), Main connector (J3.44)
USER_LED: uC (U1.54), Peripherals (D1.A)
VBAT1: uC (R2.1), MPPT_charger1 (10 pins), ideal diode1 (C22_ideal_diode1.2 Q1_ideal_diode1.5,6,7,8 U3_ideal_diode1.1)
VBAT2: uC (R1.1), MPPT_charger2 (10 pins), ideal diode2 (C22_ideal_diode2.2 Q1_ideal_diode2.5,6,7,8 U3_ideal_diode2.1)